# EAGLE schematic 3518-eagle (EAGLE 6.3)
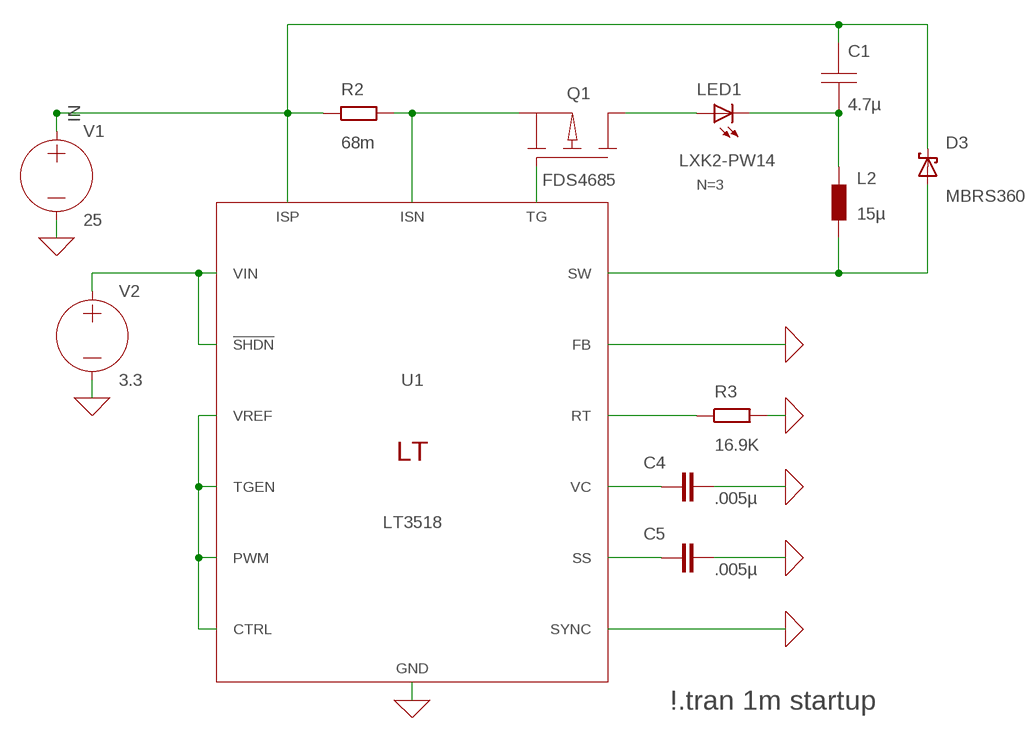
[diagram p0: schematic, sheet 1]

## Parts
C1  4.7µ  CAP  [C0805]
C4  .005µ  CC0603  [C0603]
C5  .005µ  CC0603  [C0603]
D3  MBRS360  SCHOTTKY-DIODE  [DIODE_SMB]
L2  15µ  LL2012C  [L2012C]
LED1  LXK2-PW14  LED_E  [LED_1206]
Q1  FDS4685  PMOS  [SOT23]
R2  68m  RR0603  [R0603]
R3  16.9K  RR0603  [R0603]
U1  LT3518  [TSSOP16BA(FE)]
V1  25  VOLTAGE  (no package)
V2  3.3  VOLTAGE  (no package)

## Nets
0: C4.2 C5.2 R3.2 U1.5(SYNC) U1.10(FB) U1.17(GND) V1.- V2.-
IN: C1.1(A) D3.C(A) R2.1 U1.13(ISP) V1.+
N$2: Q1.2(S) R2.2 U1.12(ISN)
N$3: LED1.A Q1.3(D)
N$4: C1.2(B) L2.1 LED1.C
N$5: Q1.1(G) U1.14(TG)
N$6: U1.1(VIN) U1.2(!SHDN) V2.+
N$8: D3.A(C) L2.2 U1.15(SW) U1.16(SW)
N$9: U1.3(VREF) U1.7(PWM) U1.8(CTRL) U1.11(TGEN)
N$10: R3.1 U1.4(RT)
N$11: C4.1 U1.9(VC)
N$12: C5.1 U1.6(SS)

## Notes on the sheet
- \!.tran 1m startup

## Library data of the parts
C1 = sym:CAP: Capacitor
C4 C5 = eagle-ltspice:C: CAPACITOR, European symbol; SPICEMODEL: NONE; SPICEPREFIX: C
D3 = eagle-ltspice:SCHOTTKY-DIODE: Schottky Diode; SPICEMODEL: NONE; SPICEPREFIX: D; SPICETYPE: diode
L2 = eagle-ltspice:L: INDUCTOR, European symbol; SPICELINE: Rpar=2K; SPICEMODEL: NONE; SPICEPREFIX: L
LED1 = eagle-ltspice:LED_E: LED Source: http://www.osram.convergy.de Source: www.luxeon.com Source: www.kingbright.com; SPICEMODEL: NONE; SPICEPREFIX: D; SPICETYPE: diode; VALUE2: N=3
Q1 = sym:PMOS: P-Channel MOSFET transistor
R2 R3 = eagle-ltspice:R: RESISTOR, European symbol; SPICEMODEL: NONE; SPICEPREFIX: R
U1 = PowerProducts:LT3518: LT-Spice library generated with : ltspice.ulp from: D:/Program Files (x86)/LTC/LTspiceIV/lib/sym/PowerProducts/LT3592*.asy at 07.10.2012 16:20:52; SPICEMODEL: LT3518.lib; SPICEPREFIX: X; VALUE2: LT3518
V1 V2 = lt-spice-simulation:VOLTAGE: Voltage Source, either DC, AC, PULSE, SINE, PWL, EXP, or SFFM